# EAGLE design BitALU (EAGLE 9.2.2)
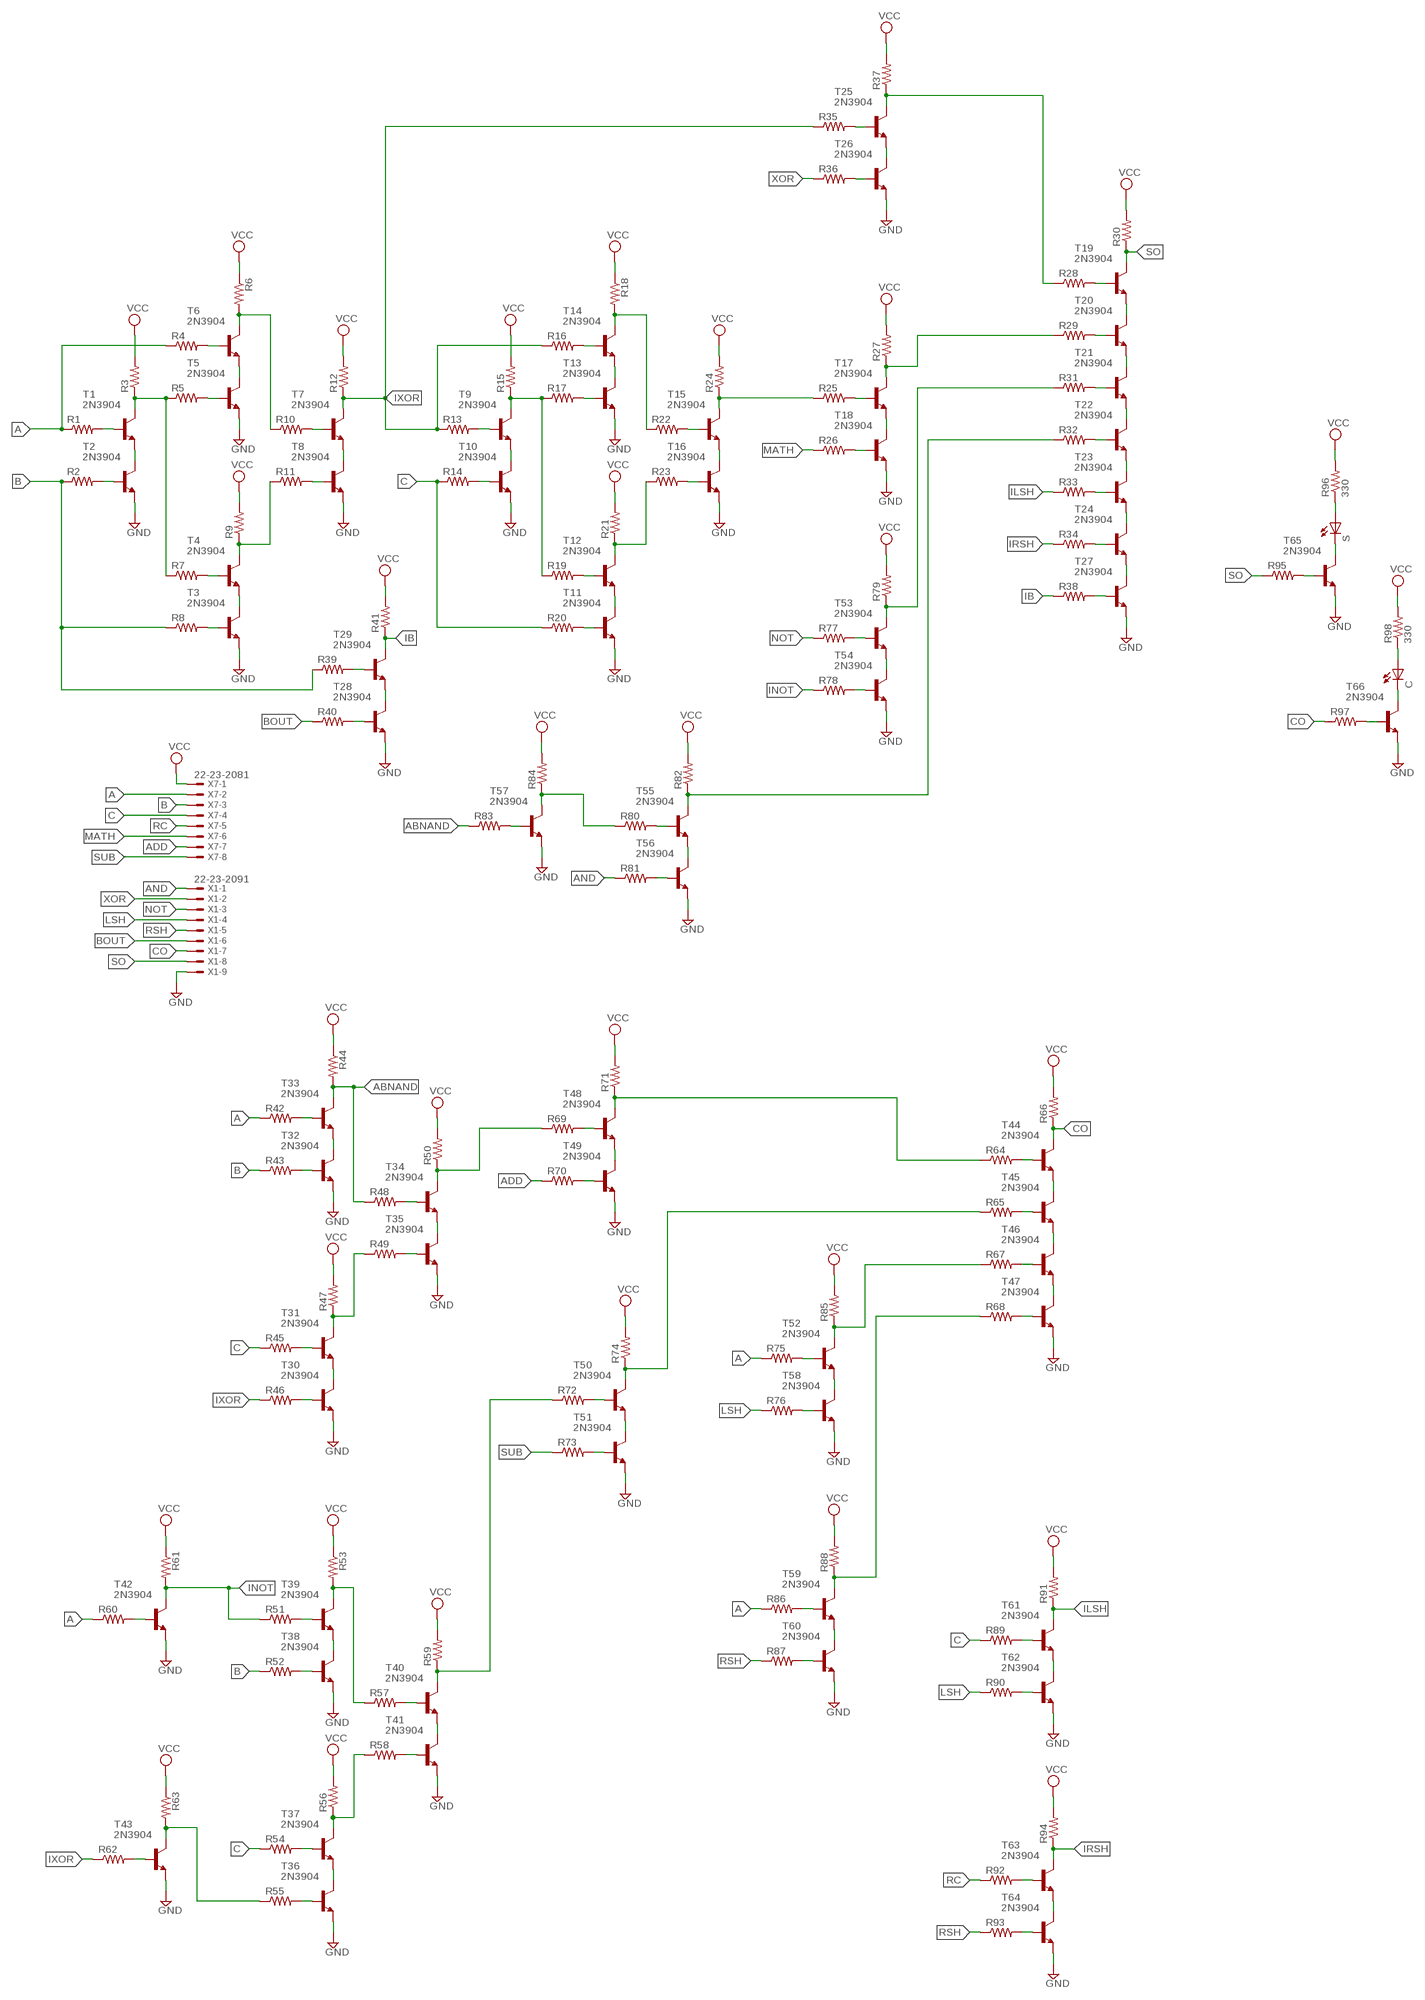
[diagram p0: schematic, sheet 1]

## Parts
C  LED5MM  [LED5MM]
R1  R-US_0309/10  [0309/10]
R2  R-US_0309/10  [0309/10]
R3  R-US_0309/10  [0309/10]
R4  R-US_0309/10  [0309/10]
R5  R-US_0309/10  [0309/10]
R6  R-US_0309/10  [0309/10]
R7  R-US_0309/10  [0309/10]
R8  R-US_0309/10  [0309/10]
R9  R-US_0309/10  [0309/10]
R10  R-US_0309/10  [0309/10]
R11  R-US_0309/10  [0309/10]
R12  R-US_0309/10  [0309/10]
R13  R-US_0309/10  [0309/10]
R14  R-US_0309/10  [0309/10]
R15  R-US_0309/10  [0309/10]
R16  R-US_0309/10  [0309/10]
R17  R-US_0309/10  [0309/10]
R18  R-US_0309/10  [0309/10]
R19  R-US_0309/10  [0309/10]
R20  R-US_0309/10  [0309/10]
R21  R-US_0309/10  [0309/10]
R22  R-US_0309/10  [0309/10]
R23  R-US_0309/10  [0309/10]
R24  R-US_0309/10  [0309/10]
R25  R-US_0309/10  [0309/10]
R26  R-US_0309/10  [0309/10]
R27  R-US_0309/10  [0309/10]
R28  R-US_0309/10  [0309/10]
R29  R-US_0309/10  [0309/10]
R30  R-US_0309/10  [0309/10]
R31  R-US_0309/10  [0309/10]
R32  R-US_0309/10  [0309/10]
R33  R-US_0309/10  [0309/10]
R34  R-US_0309/10  [0309/10]
R35  R-US_0309/10  [0309/10]
R36  R-US_0309/10  [0309/10]
R37  R-US_0309/10  [0309/10]
R38  R-US_0309/10  [0309/10]
R39  R-US_0309/10  [0309/10]
R40  R-US_0309/10  [0309/10]
R41  R-US_0309/10  [0309/10]
R42  R-US_0309/10  [0309/10]
R43  R-US_0309/10  [0309/10]
R44  R-US_0309/10  [0309/10]
R45  R-US_0309/10  [0309/10]
R46  R-US_0309/10  [0309/10]
R47  R-US_0309/10  [0309/10]
R48  R-US_0309/10  [0309/10]
R49  R-US_0309/10  [0309/10]
R50  R-US_0309/10  [0309/10]
R51  R-US_0309/10  [0309/10]
R52  R-US_0309/10  [0309/10]
R53  R-US_0309/10  [0309/10]
R54  R-US_0309/10  [0309/10]
R55  R-US_0309/10  [0309/10]
R56  R-US_0309/10  [0309/10]
R57  R-US_0309/10  [0309/10]
R58  R-US_0309/10  [0309/10]
R59  R-US_0309/10  [0309/10]
R60  R-US_0309/10  [0309/10]
R61  R-US_0309/10  [0309/10]
R62  R-US_0309/10  [0309/10]
R63  R-US_0309/10  [0309/10]
R64  R-US_0309/10  [0309/10]
R65  R-US_0309/10  [0309/10]
R66  R-US_0309/10  [0309/10]
R67  R-US_0309/10  [0309/10]
R68  R-US_0309/10  [0309/10]
R69  R-US_0309/10  [0309/10]
R70  R-US_0309/10  [0309/10]
R71  R-US_0309/10  [0309/10]
R72  R-US_0309/10  [0309/10]
R73  R-US_0309/10  [0309/10]
R74  R-US_0309/10  [0309/10]
R75  R-US_0309/10  [0309/10]
R76  R-US_0309/10  [0309/10]
R77  R-US_0309/10  [0309/10]
R78  R-US_0309/10  [0309/10]
R79  R-US_0309/10  [0309/10]
R80  R-US_0309/10  [0309/10]
R81  R-US_0309/10  [0309/10]
R82  R-US_0309/10  [0309/10]
R83  R-US_0309/10  [0309/10]
R84  R-US_0309/10  [0309/10]
R85  R-US_0309/10  [0309/10]
R86  R-US_0309/10  [0309/10]
R87  R-US_0309/10  [0309/10]
R88  R-US_0309/10  [0309/10]
R89  R-US_0309/10  [0309/10]
R90  R-US_0309/10  [0309/10]
R91  R-US_0309/10  [0309/10]
R92  R-US_0309/10  [0309/10]
R93  R-US_0309/10  [0309/10]
R94  R-US_0309/10  [0309/10]
R95  R-US_0309/10  [0309/10]
R96  330  R-US_0309/10  [0309/10]
R97  R-US_0309/10  [0309/10]
R98  330  R-US_0309/10  [0309/10]
S  LED5MM  [LED5MM]
T1  2N3904  [TO92]
T2  2N3904  [TO92]
T3  2N3904  [TO92]
T4  2N3904  [TO92]
T5  2N3904  [TO92]
T6  2N3904  [TO92]
T7  2N3904  [TO92]
T8  2N3904  [TO92]
T9  2N3904  [TO92]
T10  2N3904  [TO92]
T11  2N3904  [TO92]
T12  2N3904  [TO92]
T13  2N3904  [TO92]
T14  2N3904  [TO92]
T15  2N3904  [TO92]
T16  2N3904  [TO92]
T17  2N3904  [TO92]
T18  2N3904  [TO92]
T19  2N3904  [TO92]
T20  2N3904  [TO92]
T21  2N3904  [TO92]
T22  2N3904  [TO92]
T23  2N3904  [TO92]
T24  2N3904  [TO92]
T25  2N3904  [TO92]
T26  2N3904  [TO92]
T27  2N3904  [TO92]
T28  2N3904  [TO92]
T29  2N3904  [TO92]
T30  2N3904  [TO92]
T31  2N3904  [TO92]
T32  2N3904  [TO92]
T33  2N3904  [TO92]
T34  2N3904  [TO92]
T35  2N3904  [TO92]
T36  2N3904  [TO92]
T37  2N3904  [TO92]
T38  2N3904  [TO92]
T39  2N3904  [TO92]
T40  2N3904  [TO92]
T41  2N3904  [TO92]
T42  2N3904  [TO92]
T43  2N3904  [TO92]
T44  2N3904  [TO92]
T45  2N3904  [TO92]
T46  2N3904  [TO92]
T47  2N3904  [TO92]
T48  2N3904  [TO92]
T49  2N3904  [TO92]
T50  2N3904  [TO92]
T51  2N3904  [TO92]
T52  2N3904  [TO92]
T53  2N3904  [TO92]
T54  2N3904  [TO92]
T55  2N3904  [TO92]
T56  2N3904  [TO92]
T57  2N3904  [TO92]
T58  2N3904  [TO92]
T59  2N3904  [TO92]
T60  2N3904  [TO92]
T61  2N3904  [TO92]
T62  2N3904  [TO92]
T63  2N3904  [TO92]
T64  2N3904  [TO92]
T65  2N3904  [TO92]
T66  2N3904  [TO92]
X1  22-23-2091  [22-23-2091]
X7  22-23-2081  [22-23-2081]

## Nets
A: R1.1 R4.1 R42.1 R60.1 R75.1 R86.1 X7.2
ABNAND: R44.2 R48.1 R83.1 T33.1(C)
ADD: R70.1 X7.7
AND: R81.1 X1.1
B: R2.1 R8.1 R39.1 R43.1 R52.1 X7.3
BOUT: R40.1 X1.6
C: R14.1 R20.1 R45.1 R54.1 R89.1 X7.4
CO: R66.1 R97.1 T44.1(C) X1.7
GND: T2.3(E) T3.3(E) T5.3(E) T8.3(E) T10.3(E) T11.3(E) T13.3(E) T16.3(E) T18.3(E) T26.3(E) T27.3(E) T28.3(E) T30.3(E) T32.3(E) T35.3(E) T36.3(E) T38.3(E) T41.3(E) T42.3(E) T43.3(E) T47.3(E) T49.3(E) T51.3(E) T54.3(E) T56.3(E) T57.3(E) T58.3(E) T60.3(E) T62.3(E) T64.3(E) T65.3(E) T66.3(E) X1.9
IB: R38.1 R41.1 T29.1(C)
ILSH: R33.1 R91.1 T61.1(C)
INOT: R51.1 R61.2 R78.1 T42.1(C)
IRSH: R34.1 R94.1 T63.1(C)
IXOR: R12.1 R13.1 R16.1 R35.1 R46.1 R62.1 T7.1(C)
LSH: R76.1 R90.1 X1.4
MATH: R26.1 X7.6
N$1: R3.1 R5.1 R7.1 T1.1(C)
N$2: T1.3(E) T2.1(C)
N$3: R2.2 T2.2(B)
N$4: R1.2 T1.2(B)
N$5: R5.2 T5.2(B)
N$6: R7.2 T4.2(B)
N$7: R4.2 T6.2(B)
N$8: R6.2 R10.1 T6.1(C)
N$9: T5.1(C) T6.3(E)
N$10: R9.1 R11.1 T4.1(C)
N$11: T3.1(C) T4.3(E)
N$12: R10.2 T7.2(B)
N$13: R11.2 T8.2(B)
N$14: R28.1 R37.1 T25.1(C)
N$15: R15.1 R17.1 R19.1 T9.1(C)
N$16: R8.2 T3.2(B)
N$17: T19.3(E) T20.1(C)
N$18: T7.3(E) T8.1(C)
N$19: T9.3(E) T10.1(C)
N$20: R14.2 T10.2(B)
N$21: R13.2 T9.2(B)
N$22: R17.2 T13.2(B)
N$23: R19.2 T12.2(B)
N$24: R16.2 T14.2(B)
N$25: R18.2 R22.1 T14.1(C)
N$26: T13.1(C) T14.3(E)
N$27: R21.1 R23.1 T12.1(C)
N$28: T11.1(C) T12.3(E)
N$29: R22.2 T15.2(B)
N$30: R23.2 T16.2(B)
N$31: R24.1 R25.1 T15.1(C)
N$32: R20.2 T11.2(B)
N$33: R25.2 T17.2(B)
N$34: T15.3(E) T16.1(C)
N$35: R26.2 T18.2(B)
N$36: R27.1 R29.1 T17.1(C)
N$37: T17.3(E) T18.1(C)
N$38: T20.3(E) T21.1(C)
N$39: T21.3(E) T22.1(C)
N$40: T22.3(E) T23.1(C)
N$41: T23.3(E) T24.1(C)
N$42: R28.2 T19.2(B)
N$43: T25.3(E) T26.1(C)
N$44: R36.2 T26.2(B)
N$45: R35.2 T25.2(B)
N$46: R29.2 T20.2(B)
N$47: R31.2 T21.2(B)
N$48: R32.2 T22.2(B)
N$49: R33.2 T23.2(B)
N$50: R34.2 T24.2(B)
N$51: T24.3(E) T27.1(C)
N$52: R38.2 T27.2(B)
N$53: T32.1(C) T33.3(E)
N$54: T28.1(C) T29.3(E)
N$55: R39.2 T29.2(B)
N$56: R40.2 T28.2(B)
N$57: R43.2 T32.2(B)
N$58: R42.2 T33.2(B)
N$59: R50.1 R69.1 T34.1(C)
N$60: T34.3(E) T35.1(C)
N$61: R49.2 T35.2(B)
N$62: R48.2 T34.2(B)
N$63: R47.1 R49.1 T31.1(C)
N$64: T30.1(C) T31.3(E)
N$65: R46.2 T30.2(B)
N$66: R45.2 T31.2(B)
N$67: T44.3(E) T45.1(C)
N$68: T45.3(E) T46.1(C)
N$69: T46.3(E) T47.1(C)
N$70: R68.2 T47.2(B)
N$71: R67.2 T46.2(B)
N$72: R65.2 T45.2(B)
N$73: R64.2 T44.2(B)
N$74: R64.1 R71.1 T48.1(C)
N$75: R31.1 R79.1 T53.1(C)
N$76: T48.3(E) T49.1(C)
N$77: R70.2 T49.2(B)
N$78: R69.2 T48.2(B)
N$79: R65.1 R74.1 T50.1(C)
N$80: T50.3(E) T51.1(C)
N$81: R73.2 T51.2(B)
N$82: R72.2 T50.2(B)
N$83: R60.2 T42.2(B)
N$84: R53.2 R57.1 T39.1(C)
N$85: T38.1(C) T39.3(E)
N$86: R52.2 T38.2(B)
N$87: R51.2 T39.2(B)
N$88: R56.1 R58.1 T37.1(C)
N$89: T36.1(C) T37.3(E)
N$90: R55.2 T36.2(B)
N$91: R54.2 T37.2(B)
N$92: R59.1 R72.1 T40.1(C)
N$93: T40.3(E) T41.1(C)
N$94: R58.2 T41.2(B)
N$95: R57.2 T40.2(B)
N$96: R55.1 R63.2 T43.1(C)
N$97: R62.2 T43.2(B)
N$98: R67.1 R85.1 T52.1(C)
N$99: T52.3(E) T58.1(C)
N$100: R76.2 T58.2(B)
N$101: R75.2 T52.2(B)
N$102: R68.1 R88.1 T59.1(C)
N$103: T53.3(E) T54.1(C)
N$104: R78.2 T54.2(B)
N$105: R77.2 T53.2(B)
N$106: R83.2 T57.2(B)
N$107: R80.1 R84.1 T57.1(C)
N$108: T59.3(E) T60.1(C)
N$109: R87.2 T60.2(B)
N$110: R80.2 T55.2(B)
N$111: R32.1 R82.1 T55.1(C)
N$112: T55.3(E) T56.1(C)
N$113: R81.2 T56.2(B)
N$114: R86.2 T59.2(B)
N$115: T61.3(E) T62.1(C)
N$116: R90.2 T62.2(B)
N$117: R89.2 T61.2(B)
N$118: T63.3(E) T64.1(C)
N$119: R93.2 T64.2(B)
N$120: R92.2 T63.2(B)
N$121: R96.1 S.A
N$122: R95.2 T65.2(B)
N$123: R97.2 T66.2(B)
N$124: S.K(C) T65.1(C)
N$125: C.A R98.1
N$126: C.K(C) T66.1(C)
NOT: R77.1 X1.3
RC: R92.1 X7.5
RSH: R87.1 R93.1 X1.5
SO: R30.1 R95.1 T19.1(C) X1.8
SUB: R73.1 X7.8
VCC: R3.2 R6.1 R9.2 R12.2 R15.2 R18.1 R21.2 R24.2 R27.2 R30.2 R37.2 R41.2 R44.1 R47.2 R50.2 R53.1 R56.2 R59.2 R61.1 R63.1 R66.2 R71.2 R74.2 R79.2 R82.2 R84.2 R85.2 R88.2 R91.2 R94.2 R96.2 R98.2 X7.1
XOR: R36.1 X1.2

## Library data of the parts
C S = led:LED: LED OSRAM: - CHIPLED LG R971, LG N971, LY N971, LG Q971, LY Q971, LO R971, LY R971 LH N974, LH R974 LS Q976, LO Q976, LY Q976 LO Q996 - Hyper CHIPLED LW Q18S LB Q993, LB Q99A, LB R99A - SideLED LS A670, LO A670, LY A670, LG A670, LP A670 LB A673, LV A673, LT A673, LW A673 LH A674 LY A675 LS A676, LA A676, LO A676, LY A676, LW A676 LS A679, LY A679, LG A679 - Hyper Micro SIDELED® LS Y876, LA Y876, LO Y876, LY Y876 LT Y87S - SmartLED LW L88C, LW L88S LB L89C, LB L89S, LG L890 LS L89K, LO L89K, LY L89K LS L896, LA L896, LO L896, LY L896 - TOPLED LS T670, LO T670, LY T670, LG T670, LP T670 LSG T670, LSP T670, LSY T670, LOP T670, LYG T670 LG T671, LOG T671, LSG T671 LB T673, LV T673, LT T673, LW T673 LH T674 LS T676, LA T676, LO T676, LY T676, LB T676, LH T676, LSB T676, LW T676 LB T67C, LV T67C, LT T67C, LS T67K, LO T67K, LY T67K, LW E67C LS E67B, LA E67B, LO E67B, LY E67B, LB E67C, LV E67C, LT E67C LW T67C LS T679, LY T679, LG T679 LS T770, LO T770, LY T770, LG T770, LP T770 LB T773, LV T773, LT T773, LW T773 LH T774 LS E675, LA E675, LY E675, LS T675 LS T776, LA T776, LO T776, LY T776, LB T776 LHGB T686 LT T68C, LB T68C - Hyper Mini TOPLED® LB M676 - Mini TOPLED Santana® LG M470 LS M47K, LO M47K, LY M47K Source: http://www.osram.convergy.de LUXEON: - LUMILED® LXK2-PW12-R00, LXK2-PW12-S00, LXK2-PW14-U00, LXK2-PW14-V00 LXK2-PM12-R00, LXK2-PM12-S00, LXK2-PM14-U00 LXK2-PE12-Q00, LXK2-PE12-R00, LXK2-PE12-S00, LXK2-PE14-T00, LXK2-PE14-U00 LXK2-PB12-K00, LXK2-PB12-L00, LXK2-PB12-M00, LXK2-PB14-N00, LXK2-PB14-P00, LXK2-PB14-Q00 LXK2-PR12-L00, LXK2-PR12-M00, LXK2-PR14-Q00, LXK2-PR14-R00 LXK2-PD12-Q00, LXK2-PD12-R00, LXK2-PD12-S00 LXK2-PH12-R00, LXK2-PH12-S00 LXK2-PL12-P00, LXK2-PL12-Q00, LXK2-PL12-R00 Source: www.luxeon.com KINGBRIGHT: KA-3528ASYC Source: www.kingbright.com
R1-R98 = resistor:R-US_: RESISTOR, American symbol
T1-T66 = transistor:2N3904: NPN TRANSISTOR
X1 = con-molex:22-23-2091: .100" (2.54mm) Center Header - 9 Pin; MF: MOLEX; MPN: 22-23-2091; OC_FARNELL: 1756827; OC_NEWARK: 56H0450
X7 = con-molex:22-23-2081: .100" (2.54mm) Center Header - 8 Pin; MF: MOLEX; MPN: 22-23-2081; OC_FARNELL: 1756826; OC_NEWARK: 01C7592

## Board
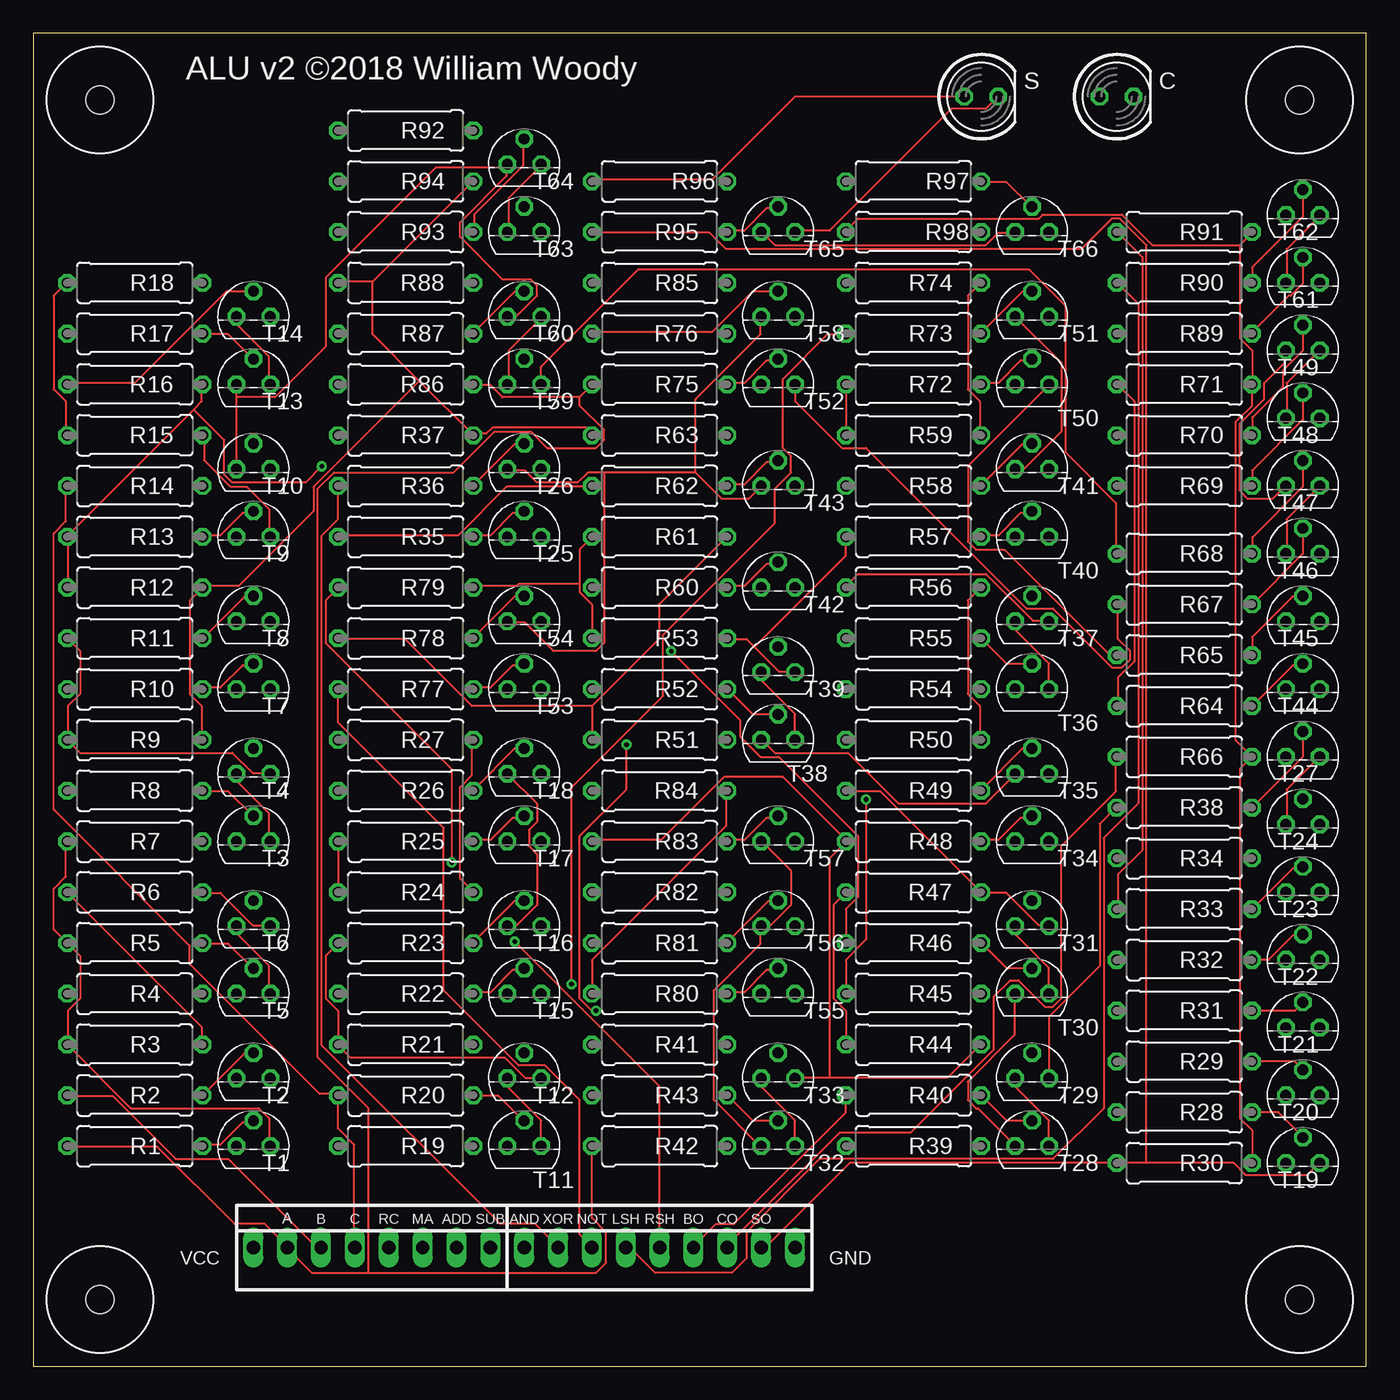
[diagram p1: board, top side]
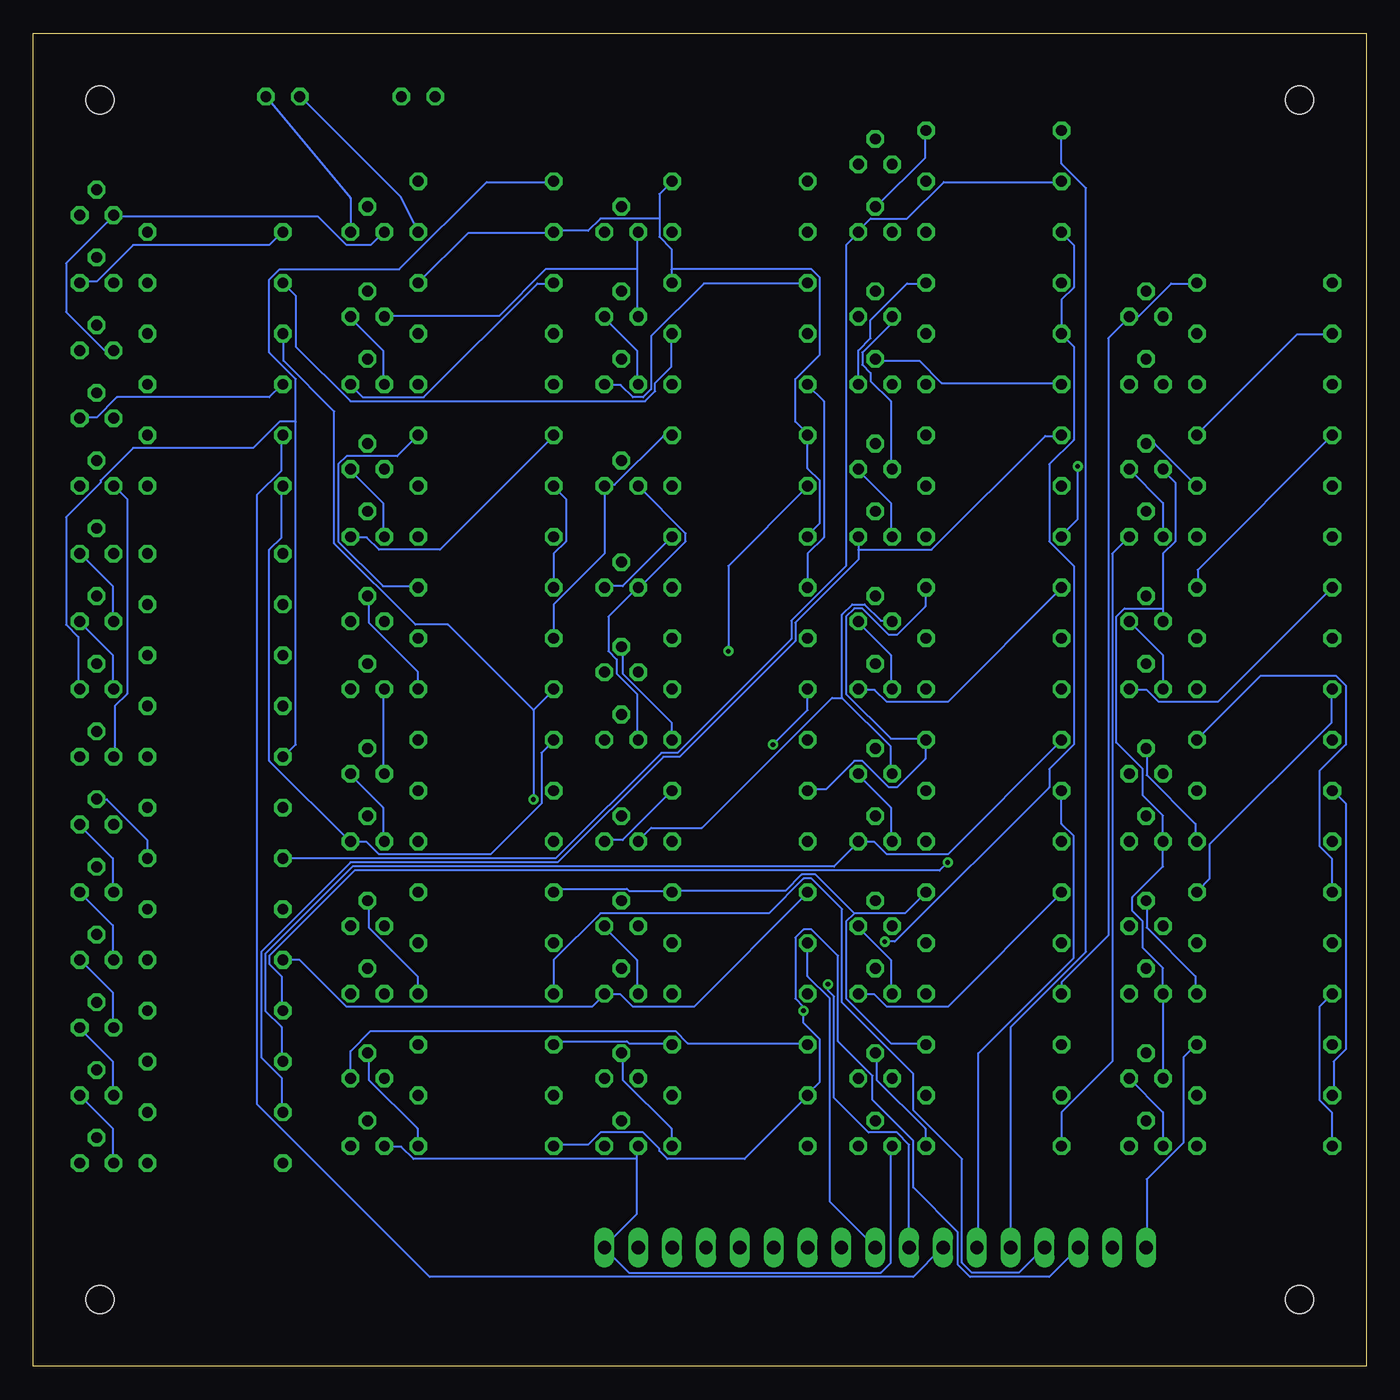
[diagram p2: board, bottom side, seen from below]

Size 100 x 100 mm. Coordinates in mm from the lower left corner, seen from the top.
Outline: 0,0 100,0 100,100 0,100 0,0
Copper layers (1*16): Top 0.035mm / dielectric 1.5mm / Bottom 0.035mm
Design rules "default": minimum track width 6mil, minimum drill 0.35mm, track to track 6mil, track to pad 6mil, pad to pad 6mil, via to via 6mil, smd to smd 6mil, copper to edge 40mil, drill to drill 6mil, minimum pad ring 10mil, minimum via ring 8mil, stop-mask expansion 4mil, vias tented up to drill 0mil, thermal gap 10mil
Holes 2.1 mm at 5,95 95,95 95,5 5,5

### Footprints (pad centres in the part's own frame; a part is rotated, then mirrored left to right if it is on the bottom)
LED5MM = drill 0.813 octagon: A -1.27,0; K 1.27,0
0309/10 = drill 0.813 octagon: 1 -5.08,0; 2 5.08,0
TO92 = drill 0.813 octagon: 1 1.27,0; 2 0,1.905; 3 -1.27,0
22-23-2091 = drill 1 long: 1 -10.16,0; 2 -7.62,0; 3 -5.08,0; 4 -2.54,0; 5 0,0; 6 2.54,0; 7 5.08,0; 8 7.62,0; 9 10.16,0
22-23-2081 = drill 1 long: 1 -8.89,0; 2 -6.35,0; 3 -3.81,0; 4 -1.27,0; 5 1.27,0; 6 3.81,0; 7 6.35,0; 8 8.89,0

### Placement (x,y rotation side)
C  81.28,95.25 0 top
R1  7.62,16.51 0 top
R2  7.62,20.32 0 top
R3  7.62,24.13 0 top
R4  7.62,27.94 0 top
R5  7.62,31.75 0 top
R6  7.62,35.56 0 top
R7  7.62,39.37 0 top
R8  7.62,43.18 0 top
R9  7.62,46.99 0 top
R10  7.62,50.8 0 top
R11  7.62,54.61 0 top
R12  7.62,58.42 0 top
R13  7.62,62.23 0 top
R14  7.62,66.04 0 top
R15  7.62,69.85 180 top
R16  7.62,73.66 180 top
R17  7.62,77.47 0 top
R18  7.62,81.28 0 top
R19  27.94,16.51 0 top
R20  27.94,20.32 0 top
R21  27.94,24.13 0 top
R22  27.94,27.94 0 top
R23  27.94,31.75 0 top
R24  27.94,35.56 0 top
R25  27.94,39.37 0 top
R26  27.94,43.18 0 top
R27  27.94,46.99 0 top
R28  86.36,19.05 0 top
R29  86.36,22.86 0 top
R30  86.36,15.24 0 top
R31  86.36,26.67 0 top
R32  86.36,30.48 0 top
R33  86.36,34.29 0 top
R34  86.36,38.1 0 top
R35  27.94,62.23 0 top
R36  27.94,66.04 0 top
R37  27.94,69.85 0 top
R38  86.36,41.91 0 top
R39  66.04,16.51 0 top
R40  66.04,20.32 0 top
R41  46.99,24.13 0 top
R42  46.99,16.51 0 top
R43  46.99,20.32 0 top
R44  66.04,24.13 0 top
R45  66.04,27.94 0 top
R46  66.04,31.75 0 top
R47  66.04,35.56 180 top
R48  66.04,39.37 0 top
R49  66.04,43.18 0 top
R50  66.04,46.99 0 top
R51  46.99,46.99 0 top
R52  46.99,50.8 0 top
R53  46.99,54.61 0 top
R54  66.04,50.8 0 top
R55  66.04,54.61 0 top
R56  66.04,58.42 0 top
R57  66.04,62.23 0 top
R58  66.04,66.04 0 top
R59  66.04,69.85 0 top
R60  46.99,58.42 0 top
R61  46.99,62.23 0 top
R62  46.99,66.04 0 top
R63  46.99,69.85 0 top
R64  86.36,49.53 0 top
R65  86.36,53.34 0 top
R66  86.36,45.72 0 top
R67  86.36,57.15 0 top
R68  86.36,60.96 0 top
R69  86.36,66.04 0 top
R70  86.36,69.85 0 top
R71  86.36,73.66 0 top
R72  66.04,73.66 0 top
R73  66.04,77.47 0 top
R74  66.04,81.28 0 top
R75  46.99,73.66 0 top
R76  46.99,77.47 180 top
R77  27.94,50.8 0 top
R78  27.94,54.61 0 top
R79  27.94,58.42 0 top
R80  46.99,27.94 0 top
R81  46.99,31.75 0 top
R82  46.99,35.56 0 top
R83  46.99,39.37 0 top
R84  46.99,43.18 180 top
R85  46.99,81.28 0 top
R86  27.94,73.66 180 top
R87  27.94,77.47 0 top
R88  27.94,81.28 180 top
R89  86.36,77.47 0 top
R90  86.36,81.28 0 top
R91  86.36,85.09 0 top
R92  27.94,92.71 0 top
R93  27.94,85.09 0 top
R94  27.94,88.9 0 top
R95  46.99,85.09 0 top
R96  46.99,88.9 0 top
R97  66.04,88.9 0 top
R98  66.04,85.09 180 top
S  71.12,95.25 0 top
T1  16.51,16.51 0 top
T2  16.51,21.59 0 top
T3  16.51,39.37 0 top
T4  16.51,44.45 0 top
T5  16.51,27.94 0 top
T6  16.51,33.02 0 top
T7  16.51,50.8 0 top
T8  16.51,55.88 0 top
T9  16.51,62.23 0 top
T10  16.51,67.31 0 top
T11  36.83,16.51 0 top
T12  36.83,21.59 0 top
T13  16.51,73.66 0 top
T14  16.51,78.74 0 top
T15  36.83,27.94 0 top
T16  36.83,33.02 0 top
T17  36.83,39.37 0 top
T18  36.83,44.45 0 top
T19  95.25,15.24 0 top
T20  95.25,20.32 0 top
T21  95.25,25.4 0 top
T22  95.25,30.48 0 top
T23  95.25,35.56 0 top
T24  95.25,40.64 0 top
T25  36.83,62.23 0 top
T26  36.83,67.31 0 top
T27  95.25,45.72 0 top
T28  74.93,16.51 0 top
T29  74.93,21.59 0 top
T30  74.93,27.94 0 top
T31  74.93,33.02 0 top
T32  55.88,16.51 0 top
T33  55.88,21.59 0 top
T34  74.93,39.37 0 top
T35  74.93,44.45 0 top
T36  74.93,50.8 0 top
T37  74.93,55.88 0 top
T38  55.88,46.99 0 top
T39  55.88,52.07 0 top
T40  74.93,62.23 0 top
T41  74.93,67.31 0 top
T42  55.88,58.42 0 top
T43  55.88,66.04 0 top
T44  95.25,50.8 0 top
T45  95.25,55.88 0 top
T46  95.25,60.96 0 top
T47  95.25,66.04 0 top
T48  95.25,71.12 0 top
T49  95.25,76.2 0 top
T50  74.93,73.66 0 top
T51  74.93,78.74 0 top
T52  55.88,73.66 0 top
T53  36.83,50.8 0 top
T54  36.83,55.88 0 top
T55  55.88,27.94 0 top
T56  55.88,33.02 0 top
T57  55.88,39.37 0 top
T58  55.88,78.74 0 top
T59  36.83,73.66 0 top
T60  36.83,78.74 0 top
T61  95.25,81.28 0 top
T62  95.25,86.36 0 top
T63  36.83,85.09 0 top
T64  36.83,90.17 0 top
T65  55.88,85.09 0 top
T66  74.93,85.09 0 top
X1  46.99,8.89 0 top
X7  25.4,8.89 0 top

### Tracks (layer width: path | path; a pad name or v marks a point on that pad's centre or on a via)
A
  Top 0.152: 41,72.69 35.2,72.69 34.29,73.61 33.07,73.61 R86.1 | 41,72.69 41.91,73.61 R75.1 | R42.1 41.91,11.12 42.98,10.06 42.98,7.77 42.22,7.01 25.15,7.01 | 25.15,7.01 20.88,7.01 19.05,8.84 X7.2 19.05,8.99 17.37,10.67 15.09,10.67 9.3,16.46 2.59,16.46 R1.1 | 41,72.69 41,72.08 42.82,70.26 42.82,69.49 42.22,68.89 38.56,68.89 37.34,70.1 34.59,70.1 31.55,67.06 22.55,67.06 21.34,65.84 21.34,23.16 25.15,19.36 25.15,7.01
  Bottom 0.152: R60.1 41.91,60.96 40.69,62.18 40.69,72.39 41.91,73.61 R75.1 | R4.1 3.5,26.98 3.5,19.96 2.59,19.05 2.59,16.61 R1.1
ABNAND
  Top 0.152: 59.74,21.64 68.58,21.64 71.02,24.08 R44.2 | 59.74,21.64 57.15,21.64 T33.1 | R83.1 41.91,39.47 47.09,39.47 51.82,44.2 56.24,44.2 60.96,39.47 R48.1 60.96,39.32 59.74,38.1 59.74,21.64
ADD
  Bottom 0.152: R70.1 81.38,69.8 81.38,67.21 83.21,65.38 83.21,19.66 70.26,6.71 33.98,6.71 31.85,8.84 X7.7
AND
  Bottom 0.152: R81.1 41.91,29.26 40.23,27.58 40.23,12.34 36.88,8.99 X1.1
B  (via drill 0.35)
  Top 0.152: v44.5,46.63 44.5,43.28 41,39.78 41,27.58 41.91,26.67 v42.22,26.67 | X7.3 21.49,8.99 21.18,8.99 14.63,15.54 10.67,15.54 5.94,20.27 2.59,20.27 R2.1
  Bottom 0.152: R39.1 60.96,16.61 58.37,16.61 57.45,17.53 54.25,17.53 53.03,16.31 53.03,16.15 52.43,15.54 46.63,15.54 41.91,20.27 R43.1 41.91,20.42 41,21.34 41,24.54 42.22,25.76 v42.22,26.67 42.22,26.98 42.82,27.58 42.82,32.16 42.22,32.77 41.6,32.77 39.62,30.79 39.62,24.38 37.03,21.79 37.03,19.96 33.98,16.92 33.98,13.41 30.63,10.06 30.63,7.62 29.72,6.71 23.77,6.71 X7.3 | R52.1 41.91,49.23 v44.5,46.63 | R2.1 2.44,20.42 2.44,22.86 1.52,23.77 1.52,42.22 2.44,43.13 R8.1
BOUT
  Top 0.152: R40.1 60.96,19.05 52.58,10.67 51.21,10.67 49.53,8.99 X1.6
C  (via drill 0.35)
  Top 0.152: R45.1 60.96,30.48 62.48,32 v62.48,42.52 | X7.4 24.08,8.99 24.08,16.61 22.86,17.83 R20.1 22.86,20.42 21.49,20.42 11.73,30.18 11.73,31.55 1.52,41.76 1.52,62.48 2.44,63.4 2.44,65.99 R14.1
  Bottom 0.152: 62.48,49.23 v62.48,42.52 | 62.48,49.23 60.96,50.75 R54.1 | 62.48,49.23 68.89,55.63 71.32,55.63 77.42,61.72 77.42,71.63 81.23,75.44 81.23,77.42 R89.1 | R45.1 60.96,30.48 57.45,33.98 44.81,33.98 42.22,36.58 41.6,36.58 39.32,34.29 39.32,27.28 33.98,21.95 33.98,19.2 30.33,15.54 30.33,7.77 29.57,7.01 26.06,7.01 24.23,8.84 X7.4
CO
  Top 0.152: R66.1 81.23,45.72 81.23,43.13 77.11,39.01 77.11,27.58 76.5,26.98 75.89,26.98 73.91,28.96 73.3,28.96 72.08,27.74 72.08,23.77 65.84,17.53 60.5,17.53 51.97,8.99 X1.7
  Bottom 0.152: 80.31,70.87 80.31,46.63 81.23,45.72 R66.1 | 80.31,70.87 80.31,74.07 82.3,76.05 82.3,81.53 81.53,82.3 72.54,82.3 65.99,88.85 60.96,88.85 R97.1 | 80.31,70.87 81.53,70.87 83.52,68.89 92.51,68.89 94.94,66.45 94.94,66.29 97.54,63.7 97.54,55.63 96.62,54.71 96.62,50.9 T44.1
GND
  Top 0.152: T18.3 37.8,42.22 37.8,40.84 37.19,40.23 37.19,39.01 37.8,38.41 37.8,34.59 36.27,33.07 35.66,33.07 T16.3 | T28.3 73.61,16.61 70.87,19.36 70.71,19.36 70.1,19.96 70.1,21.34 73.61,24.84 73.61,27.89 T30.3 | T57.3 54.71,39.32 56.84,37.19 56.84,34.59 55.32,33.07 54.71,33.07 T56.3 54.56,32.92 54.56,31.7 51.05,28.19 51.05,19.96 54.56,16.46 T32.3 | T10.3 15.24,72.69 | 15.24,72.69 T13.3 | T49.3 93.88,76.2 93.88,75.29 92.35,73.76 92.35,72.54 90.53,70.71 90.53,65.68 91.14,65.08 92.96,65.08 93.88,65.99 T47.3 | T51.3 77.11,75.29 77.11,70.1 74.37,67.36 73.76,67.36 T41.3 | T66.3 73.61,85.04 72.39,85.04 71.48,84.12 55.63,84.12 54.71,85.04 T65.3 | 35.51,89.92 35.51,89.31 32,85.8 32,84.73 35.2,81.53 37.34,81.53 37.8,81.08 37.8,80.31 36.27,78.79 35.66,78.79 T60.3 | 35.51,89.92 35.51,90.07 T64.3 35.51,89.92 | T35.3 73.61,44.35 71.48,42.22 64.92,42.22 61.11,46.02 55.63,46.02 54.71,46.94 T38.3 | 49.68,67.06 42.82,67.06 | 42.82,67.06 41.6,67.06 40.84,66.29 37.8,66.29 36.88,67.21 35.66,67.21 T26.3 | 49.68,67.06 51.66,65.08 53.65,65.08 T43.3 | 49.68,67.06 49.68,72.54 54.56,77.42 54.56,78.64 T58.3 | 15.24,72.69 18.14,72.69 21.95,76.5 21.95,81.69 30.18,89.92 35.51,89.92 | 42.82,67.06 42.82,54.25 42.22,53.65 39.01,53.65 36.88,55.78 35.66,55.78 T54.3
  Bottom 0.152: 39.32,50.14 39.32,56.39 38.56,57.15 37.64,57.15 36.42,55.93 35.66,55.93 T54.3 | 39.32,50.14 35.66,46.48 35.66,44.5 T18.3 | T11.3 35.66,16.46 35.66,7.77 36.42,7.01 55.32,7.01 57.15,8.84 X1.9 57.15,8.99 54.71,11.43 54.71,15.54 | 54.71,15.54 54.71,16.46 T32.3 | 54.71,15.54 71.48,15.54 72.39,16.46 73.61,16.46 T28.3 | 39.32,50.14 40.08,50.14 49.84,40.39 53.65,40.39 54.56,39.47 T57.3 | 15.24,56.84 15.24,60.96 14.33,61.87 14.33,66.29 15.24,67.21 T10.3 | 15.24,56.84 T8.3 | T2.3 T5.3 15.24,29.87 16.76,31.39 16.76,33.38 17.53,34.14 17.53,35.2 15.24,37.49 T3.3 15.24,41.3 16.76,42.82 16.76,44.81 18.75,46.79 18.75,56.24 18.14,56.84 15.24,56.84 | T49.3 94.64,76.2 97.54,79.1 97.54,82.75 94.03,86.26 T62.3 93.88,86.26 78.64,86.26 76.5,84.12 74.68,84.12 73.76,85.04 T66.3 | T27.3 93.88,45.72 93.88,49.53 92.96,50.44 92.96,65.08 93.88,65.99 T47.3 | 54.71,82.3 54.71,85.04 T65.3 | 54.71,82.3 54.71,78.79 T58.3 | 54.71,82.3 61.57,82.3 65.08,78.79 73.61,78.79 T51.3 | T26.3 35.66,67.36 35.66,72.39 37.19,73.91 37.19,74.52 37.8,75.13 37.8,76.05 35.66,78.18 35.66,78.64 T60.3 | T35.3 73.76,44.5 73.76,50.75 T36.3 | T38.3 54.71,47.09 54.71,50.44 56.24,51.97 56.24,53.03 56.84,53.65 56.84,56.24 54.71,58.37 T42.3 54.56,58.37 51.05,61.87 51.05,62.48 T43.3
IB
  Top 0.152: T29.1 76.2,26.21 80.01,30.02 80.01,40.69 81.23,41.91 R38.1
  Bottom 0.152: T29.1 76.2,23.62 74.68,25.15 51.82,25.15 50.9,24.23 41.91,24.23 R41.1
ILSH
  Top 0.152: R33.1 81.38,34.29 81.38,36.88 83.21,38.71 83.21,83.21 81.38,85.04 R91.1
  Bottom 0.152: T61.1 96.47,81.38 95.25,81.38 92.51,84.12 82.3,84.12 81.38,85.04 R91.1
INOT
  Top 0.152: 41.91,49.53 R51.1 | 41.91,49.53 46.94,54.56 46.94,57.15 51.97,62.18 R61.2 | 41.91,49.53 32.92,49.53 27.89,54.56 22.86,54.56 R78.1
  Bottom 0.152: R61.2 55.78,58.52 57.15,58.52 T42.1
IRSH
  Bottom 0.152: R34.1 60.81,38.1 52.88,46.02 51.66,46.02 43.13,54.56 43.13,55.93 39.01,60.05 39.01,84.12 38.1,85.04 T63.1 38.1,85.19 37.19,86.11 34.44,86.11 31.7,88.85 22.86,88.85 R94.1
IXOR  (via drill 0.35)
  Top 0.152: R12.1 2.59,58.52 2.59,62.18 R13.1 2.59,62.33 12.04,71.78 | 12.04,71.78 12.65,72.39 12.65,73.61 R16.1 | R46.1 60.96,34.29 61.87,35.2 61.87,39.78 55.93,45.72 54.56,45.72 53.03,47.24 53.03,48.46 v47.85,53.65 | R35.1 22.86,62.33 31.85,62.33 35.51,65.99 41.91,65.99 R62.1 | 12.04,71.78 14.33,69.49 14.33,66.9 14.94,66.29 20.42,66.29 v21.64,67.51
  Bottom 0.152: R12.1 11.12,49.84 15.54,49.84 16.46,50.75 17.68,50.75 T7.1 | v47.85,53.65 47.85,60.05 41.91,65.99 R62.1 | v21.64,67.51 21.64,63.55 22.86,62.33 R35.1
LSH
  Top 0.152: X1.4 44.5,8.84 44.81,8.84 46.63,7.01 52.43,7.01 53.49,8.08 53.49,10.06 58.98,15.54 76.5,15.54 80.31,19.36 80.31,39.62 82.91,42.22 82.91,79.7 81.38,81.23 R90.1
  Bottom 0.152: R90.1 80.31,80.31 80.31,76.5 76.2,72.39 54.1,72.39 53.34,73.15 53.34,73.76 52.12,74.98 52.12,77.42 R76.1
MATH
  Bottom 0.152: R26.1 22.86,40.69 21.95,39.78 21.95,30.63 29.11,23.47 29.11,8.99 X7.6
N$1
  Top 0.152: T1.1 17.68,16.61 17.68,18.59 16.92,19.36 7.32,19.36 R3.1 2.59,24.23 2.59,26.67 3.5,27.58 3.5,30.79 R5.1 1.52,32.77 1.52,35.81 2.44,36.73 2.44,39.32 R7.1
N$2
  Bottom 0.152: T1.3 15.24,19.05 T2.1
N$3
  Top 0.152: R2.2 15.85,23.47 16.46,23.47 T2.2
N$4
  Top 0.152: R1.2 12.8,16.61 14.02,16.61 15.7,18.29 16.46,18.29 T1.2
N$5
  Top 0.152: R5.2 12.8,31.7 14.63,31.7 16.46,29.87 T5.2
N$6
  Bottom 0.152: R7.2 12.8,39.47 12.8,40.69 16.46,44.35 16.46,46.33 T4.2
N$7
  Bottom 0.152: R4.2 12.8,28.04 12.8,29.26 16.46,32.92 16.46,34.9 T6.2
N$8
  Top 0.152: T6.1 17.68,33.07 16.46,33.07 14.02,35.51 12.8,35.51 R6.2
  Bottom 0.152: R10.1 2.59,50.75 2.59,48.31 11.73,39.17 11.73,36.58 12.65,35.66 R6.2
N$9
  Top 0.152: T6.3 15.24,32.46 17.68,30.02 17.68,28.04 T5.1
N$10
  Top 0.152: R11.1 3.5,53.65 3.5,50.44 2.59,49.53 2.59,47.09 R9.1 3.5,46.02 14.94,46.02 16.46,44.5 17.68,44.5 T4.1
N$11
  Top 0.152: T4.3 15.24,43.89 17.68,41.45 17.68,39.47 T3.1
N$12
  Top 0.152: R10.2 12.8,50.9 14.02,50.9 15.7,52.58 16.46,52.58 T7.2
N$13
  Top 0.152: R11.2 15.85,57.76 16.46,57.76 T8.2
N$14
  Bottom 0.152: T25.1 38.1,61.27 | 38.1,61.27 38.1,60.5 42.82,55.78 42.82,54.41 51.51,45.72 52.73,45.72 60.66,37.8 76.2,37.8 82.91,31.09 82.91,23.16 81.38,21.64 81.38,19.05 R28.1 | 38.1,61.27 32.61,61.27 24.08,69.8 22.86,69.8 R37.1
N$15
  Top 0.152: T9.1 17.68,62.33 17.68,64.31 16,65.99 14.78,65.99 12.8,67.97 12.8,69.8 R15.1
  Bottom 0.152: R17.1 2.59,77.42 5.18,77.42 12.65,69.95 R15.1 | R19.1 22.86,19.05 19.05,22.86 19.05,60.96 T9.1
N$16
  Top 0.152: R8.2 12.8,43.13 14.63,43.13 16.46,41.3 T3.2
N$17
  Bottom 0.152: T20.1 94.03,17.83 94.03,15.24 T19.3
N$18
  Bottom 0.152: T7.3 15.24,53.34 T8.1
N$19
  Bottom 0.152: T9.3 15.24,64.77 T10.1
N$20
  Bottom 0.152: R14.2 15.85,69.19 16.46,69.19 T10.2
N$21
  Top 0.152: R13.2 12.8,62.33 14.02,62.33 15.7,64.01 16.46,64.01 T9.2
N$22
  Top 0.152: R17.2 12.8,77.42 14.63,77.42 16.46,75.59 T13.2
N$23
  Bottom 0.152: R19.2 33.07,16.61 33.07,17.83 36.73,21.49 36.73,23.47 T12.2
N$24
  Top 0.152: R16.2 2.59,73.76 7.62,73.76 14.48,80.62 16.46,80.62 T14.2
N$25
  Bottom 0.152: R18.2 12.8,81.23 14.63,81.23 17.07,78.79 17.68,78.79 T14.1 17.83,78.64 19.36,77.11 19.36,32.31 22.86,28.8 R22.1
N$26
  Top 0.152: T14.3 15.24,78.18 17.68,75.74 17.68,73.76 T13.1
N$27
  Top 0.152: R23.1 22.86,31.7 21.95,30.79 21.95,27.58 22.86,26.67 R21.1 22.86,24.08 23.77,23.16 35.36,23.16 36.88,21.64 38.1,21.64 T12.1
N$28
  Top 0.152: T11.1 38.1,18.44 35.66,20.88 35.66,21.49 T12.3
N$29
  Top 0.152: R22.2 33.07,28.04 34.29,28.04 35.97,29.72 36.73,29.72 T15.2
N$30
  Top 0.152: R23.2 33.07,31.85 36.12,34.9 36.73,34.9 T16.2
N$31
  Top 0.152: R25.1 R24.1
  Bottom 0.152: T15.1 38.1,27.89 36.88,27.89 35.97,26.98 31.39,26.98 22.86,35.51 R24.1
N$32
  Top 0.152: R20.2 33.07,20.27 34.9,20.27 36.73,18.44 T11.2
N$33
  Top 0.152: R25.2 33.07,39.47 34.29,39.47 35.97,41.15 36.73,41.15 T17.2
N$34
  Bottom 0.152: T15.3 35.66,28.04 35.66,30.48 38.1,32.92 T16.1
N$35
  Top 0.152: R26.2 33.07,43.28 36.12,46.33 36.73,46.33 T18.2
N$36
  Bottom 0.152: 38.1,39.32 36.88,39.32 35.97,38.41 31.39,38.41 22.86,46.94 R27.1 | 38.1,39.32 39.93,37.49 76.05,37.49 82.6,30.94 82.6,26.67 81.38,25.45 81.38,22.86 R29.1 | 38.1,39.32 T17.1
N$37
  Bottom 0.152: T17.3 35.66,39.47 35.66,41.91 38.1,44.35 T18.1
N$38
  Bottom 0.152: T20.3 94.03,20.42 94.03,22.86 96.47,25.3 T21.1
N$39
  Bottom 0.152: T21.3 94.03,25.45 94.03,28.04 96.47,30.48 T22.1
N$40
  Bottom 0.152: T23.1 94.03,33.07 94.03,30.48 T22.3
N$41
  Bottom 0.152: T23.3 94.03,35.66 94.03,38.1 96.47,40.54 T24.1
N$42
  Top 0.152: R28.2 93.42,19.05 95.25,17.22 T19.2
N$43
  Bottom 0.152: T25.3 35.66,62.33 35.66,64.77 38.1,67.21 T26.1
N$44
  Top 0.152: R36.2 33.07,66.14 36.12,69.19 36.73,69.19 T26.2
N$45
  Top 0.152: R35.2 33.07,62.33 34.29,62.33 35.97,64.01 36.73,64.01 T25.2
N$46
  Top 0.152: R29.2 94.64,22.86 95.25,22.25 T20.2
N$47
  Top 0.152: R31.2 94.64,26.67 95.25,27.28 T21.2
N$48
  Top 0.152: R32.2 92.66,30.48 94.49,32.31 95.25,32.31 T22.2
N$49
  Top 0.152: R33.2 94.49,37.34 95.25,37.34 T23.2
N$50
  Bottom 0.152: R34.2 91.44,39.47 94.49,42.52 95.25,42.52 T24.2
N$51
  Top 0.152: T24.3 94.03,40.69 94.03,43.28 96.47,45.72 T27.1
N$52
  Top 0.152: R38.2 95.25,45.72 T27.2
N$53
  Top 0.152: T32.1 57.15,18.44 54.71,20.88 54.71,21.49 T33.3
N$54
  Top 0.152: T28.1 76.2,18.44 73.76,20.88 73.76,21.49 T29.3
N$55
  Bottom 0.152: R39.2 71.17,16.61 71.17,17.83 74.83,21.49 74.83,23.47 T29.2
N$56
  Top 0.152: R40.2 73,18.44 74.83,18.44 T28.2
N$57
  Top 0.152: R43.2 53.95,18.44 55.78,18.44 T32.2
N$58
  Bottom 0.152: R42.2 52.12,16.61 52.12,17.83 55.78,21.49 55.78,23.47 T33.2
N$59
  Bottom 0.152: 76.2,39.32 74.98,39.32 74.07,38.41 65.68,38.41 61.87,42.22 61.87,46.02 60.96,46.94 R50.1 | 76.2,39.32 82.3,45.41 82.3,61.27 81.38,62.18 81.38,65.99 R69.1 | 76.2,39.32 T34.1
N$60
  Bottom 0.152: T34.3 73.76,39.47 73.76,41.91 76.2,44.35 T35.1
N$61
  Top 0.152: R49.2 71.17,43.28 74.22,46.33 74.83,46.33 T35.2
N$62
  Top 0.152: R48.2 71.17,39.47 72.39,39.47 74.07,41.15 74.83,41.15 T34.2
N$63
  Top 0.152: T31.1 76.2,33.07 75.44,33.07 73,35.51 71.17,35.51 R47.1 63.55,43.13 60.96,43.13 R49.1
N$64
  Top 0.152: T30.1 76.2,29.87 73.76,32.31 73.76,32.92 T31.3
N$65
  Top 0.152: R46.2 73,29.87 74.83,29.87 T30.2
N$66
  Bottom 0.152: R45.2 71.17,28.04 71.17,29.26 74.83,32.92 74.83,34.9 T31.2
N$67
  Bottom 0.152: T44.3 94.03,50.9 94.03,53.34 96.47,55.78 T45.1
N$68
  Bottom 0.152: T45.3 94.03,55.93 94.03,58.52 96.47,60.96 T46.1
N$69
  Top 0.152: T47.1 94.03,63.55 94.03,60.96 T46.3
N$70
  Top 0.152: R68.2 91.44,62.18 95.25,65.99 T47.2
N$71
  Top 0.152: R67.2 95.25,60.96 T46.2
N$72
  Top 0.152: R65.2 91.44,54.71 94.49,57.76 95.25,57.76 T45.2
N$73
  Top 0.152: R64.2 94.49,52.58 95.25,52.58 T44.2
N$74
  Top 0.152: R64.1 81.38,49.53 81.38,51.66 82.6,52.88 82.6,72.39 81.38,73.61 R71.1
  Bottom 0.152: T48.1 96.47,71.17 95.25,71.17 93.73,72.69 82.3,72.69 81.38,73.61 R71.1
N$75  (via drill 0.35)
  Top 0.152: v31.39,37.8 31.39,44.81 21.95,54.25 21.95,57.45 22.86,58.37 R79.1
  Bottom 0.152: T53.1 38.1,50.75 36.88,50.75 35.97,49.84 31.39,49.84 22.86,58.37 R79.1 | v31.39,37.8 32,37.19 75.89,37.19 82.3,30.79 82.3,30.18 81.38,29.26 81.38,26.67 R31.1
N$76
  Top 0.152: T48.3 94.03,71.17 94.03,73.76 96.47,76.2 T49.1
N$77
  Top 0.152: R70.2 91.44,71.17 93.73,73.46 93.73,74.68 95.25,76.2 T49.2
N$78
  Top 0.152: R69.2 91.44,67.21 95.25,71.02 T48.2
N$79
  Top 0.152: R65.1 80.77,53.34 72.85,61.27 70.71,61.27 70.1,61.87 70.1,67.51 76.2,73.61 T50.1
  Bottom 0.152: R74.1 60.96,81.23 62.18,81.23 70.71,72.69 75.29,72.69 76.2,73.61 T50.1
N$80
  Bottom 0.152: T50.3 73.76,73.76 73.76,76.2 76.2,78.64 T51.1
N$81
  Top 0.152: R73.2 71.17,77.57 74.22,80.62 74.83,80.62 T51.2
N$82
  Top 0.152: R72.2 71.17,73.76 72.39,73.76 74.07,75.44 74.83,75.44 T50.2
N$83
  Top 0.152: R60.2 52.12,58.52 53.34,58.52 55.02,60.2 55.78,60.2 T42.2
N$84
  Top 0.152: 54.1,53.95 53.49,54.56 52.12,54.56 R53.2 | 54.1,53.95 55.93,52.12 57.15,52.12 T39.1 | R57.1 60.96,60.81 54.1,53.95
N$85
  Top 0.152: T38.1 57.15,48.92 54.71,51.36 54.71,51.97 T39.3
N$86
  Top 0.152: R52.2 53.95,48.92 55.78,48.92 T38.2
N$87
  Bottom 0.152: R51.2 52.12,47.09 52.12,48.31 55.78,51.97 55.78,53.95 T39.2
N$88
  Top 0.152: T37.1 76.2,55.93 74.98,55.93 71.48,59.44 61.87,59.44 60.96,58.52 R56.1
  Bottom 0.152: R56.1 60.96,60.96 60.05,61.87 60.05,65.08 60.96,65.99 R58.1
N$89
  Top 0.152: T36.1 76.2,52.73 73.76,55.17 73.76,55.78 T37.3
N$90
  Top 0.152: R55.2 73,52.73 74.83,52.73 T36.2
N$91
  Bottom 0.152: R54.2 71.17,50.9 71.17,52.12 74.83,55.78 74.83,57.76 T37.2
N$92
  Top 0.152: R72.1 R59.1
  Bottom 0.152: T40.1 76.2,62.18 74.98,62.18 74.07,61.27 69.49,61.27 60.96,69.8 R59.1
N$93
  Bottom 0.152: T40.3 73.76,62.33 73.76,64.77 76.2,67.21 T41.1
N$94
  Top 0.152: R58.2 71.17,66.14 74.22,69.19 74.83,69.19 T41.2
N$95
  Top 0.152: R57.2 71.17,62.33 72.39,62.33 74.07,64.01 74.83,64.01 T40.2
N$96
  Bottom 0.152: R63.2 52.12,69.8 52.73,69.8 56.39,66.14 57.15,66.14 T43.1 57.15,60.96 60.96,57.15 R55.1
N$97
  Top 0.152: R62.2 52.12,66.14 53.34,66.14 55.02,67.82 55.78,67.82 T43.2
N$98
  Top 0.152: T52.1 57.15,72.39 60.66,68.89 62.48,68.89 74.52,56.84 76.5,56.84 80.92,52.43 81.69,52.43 82.3,53.03 82.3,53.65 81.38,54.56 81.38,57.15 R67.1
  Bottom 0.152: T52.1 57.15,73.61 55.93,73.61 55.02,72.69 54.25,72.69 53.65,73.3 53.65,77.27 49.68,81.23 41.91,81.23 R85.1
N$99
  Bottom 0.152: T52.3 54.71,73.76 54.71,76.2 57.15,78.64 T58.1
N$100
  Top 0.152: R76.2 41.91,77.57 50.9,77.57 53.95,80.62 55.78,80.62 T58.2
N$101
  Top 0.152: R75.2 52.12,73.76 53.34,73.76 55.02,75.44 55.78,75.44 T52.2
N$102
  Top 0.152: T59.1 38.1,74.98 45.41,82.3 74.68,82.3 77.42,79.55 77.42,68.58 81.23,64.77 81.23,60.96 R68.1
  Bottom 0.152: T59.1 38.1,76.2 37.19,77.11 37.19,78.49 34.44,81.23 33.07,81.23 R88.1
N$103
  Bottom 0.152: T53.3 35.66,50.9 35.66,53.34 38.1,55.78 T54.1
N$104
  Top 0.152: R78.2 33.07,54.71 36.12,57.76 36.73,57.76 T54.2
N$105
  Top 0.152: R77.2 33.07,50.9 34.29,50.9 35.97,52.58 36.73,52.58 T53.2
N$106
  Top 0.152: R83.2 52.12,39.47 53.34,39.47 55.02,41.15 55.78,41.15 T57.2
N$107
  Top 0.152: R80.1 41.91,30.48 51.97,40.54 51.97,43.13 R84.1
  Bottom 0.152: R84.1 55.78,39.47 57.15,39.47 T57.1
N$108
  Top 0.152: T59.3 35.66,73.76 35.66,76.2 38.1,78.64 T60.1
N$109
  Top 0.152: R87.2 33.07,77.57 36.12,80.62 36.73,80.62 T60.2
N$110
  Top 0.152: R80.2 52.12,28.04 53.34,28.04 55.02,29.72 55.78,29.72 T55.2
N$111
  Bottom 0.152: 57.15,27.89 55.93,27.89 55.02,26.98 50.44,26.98 41.91,35.51 R82.1 | R32.1 80.01,30.48 76.5,26.98 58.06,26.98 57.15,27.89 | 57.15,27.89 T55.1
N$112
  Bottom 0.152: T55.3 54.71,28.04 54.71,30.48 57.15,32.92 T56.1
N$113
  Top 0.152: R81.2 52.12,31.85 55.17,34.9 55.78,34.9 T56.2
N$114
  Bottom 0.152: R86.2 22.86,73.76 31.85,73.76 33.53,75.44 36.73,75.44 T59.2
N$115
  Top 0.152: T61.3 94.03,81.38 94.03,83.82 96.47,86.26 T62.1
N$116
  Top 0.152: R90.2 91.44,82.45 95.25,86.26 T62.2
N$117
  Top 0.152: T61.2 95.25,81.23 94.34,80.31 94.18,80.31 91.44,77.57 R89.2
N$118
  Top 0.152: T63.3 35.66,85.19 35.66,87.63 38.1,90.07 T64.1
N$119
  Top 0.152: R93.2 33.07,85.19 33.07,86.41 36.73,90.07 36.73,92.05 T64.2
N$120
  Bottom 0.152: R92.2 33.07,92.66 33.07,90.68 36.73,87.02 T63.2
N$121
  Top 0.152: S.A 57.15,95.25 50.9,89 41.91,89 R96.1
N$122
  Top 0.152: R95.2 52.12,85.19 53.34,85.19 55.02,86.87 55.78,86.87 T65.2
N$123
  Top 0.152: R97.2 71.17,88.85 73,88.85 74.83,87.02 T66.2
N$124
  Top 0.152: S.K 71.48,94.34 68.89,94.34 59.74,85.19 57.15,85.19 T65.1
N$125
  Bottom 0.152: C.A 79.96,95.25 72.44,87.73 R98.1
N$126
  Bottom 0.152: T66.1 76.2,87.63 C.K
NOT
  Top 0.152: R77.1 22.86,48.31 30.79,40.39 30.79,28.19 36.42,22.55 38.41,22.55 41,19.96 41,9.91 41.91,8.99 X1.3
RC
  Bottom 0.152: R92.1 22.86,90.22 21.03,88.39 21.03,31.09 26.67,25.45 X7.5
RSH  (via drill 0.35)
  Top 0.152: v36.12,31.85 46.94,21.03 46.94,8.99 X1.5
  Bottom 0.152: R93.1 22.86,85.04 21.95,84.12 21.95,80.92 22.86,80.01 R87.1 22.86,77.42 21.95,76.5 21.95,69.49 23.77,67.67 23.77,61.87 21.95,60.05 21.95,46.63 23.77,44.81 23.77,43.43 35.36,31.85 v36.12,31.85
SO
  Top 0.152: 83.52,15.24 90.07,15.24 90.98,14.33 95.56,14.33 96.47,15.24 T19.1 | 83.52,15.24 R30.1 61.27,15.24 55.02,8.99 54.71,8.99 X1.8 | 83.52,15.24 83.52,84.12 81.53,86.11 80.92,86.11 78.64,83.82 51.97,83.82 50.75,85.04 41.91,85.04 R95.1
SUB  (via drill 0.35)
  Top 0.152: v40.39,28.65 40.39,43.43 47.24,50.29 47.24,54.86 55.63,63.25 55.63,65.84 56.84,67.06 56.84,68.28 56.24,68.89 56.24,74.07 59.59,77.42 60.96,77.42 R73.1
  Bottom 0.152: v40.39,28.65 40.39,28.19 39.93,27.74 39.93,20.12 37.34,17.53 35.2,17.53 34.29,16.61 X7.8
VCC
  Top 0.152: R6.1 12.65,25.45 12.65,24.23 R3.2 | R9.2 12.65,47.09 12.65,49.53 11.73,50.44 11.73,57.45 R12.2 12.8,58.52 15.39,58.52 21.03,64.16 21.03,65.99 28.96,73.91 | R15.2 2.44,69.95 2.44,72.39 1.52,73.3 1.52,80.31 2.44,81.23 R18.1 | 90.53,84.12 90.53,77.11 91.44,76.2 R71.2 91.44,72.08 90.22,70.87 90.22,46.94 R66.2 90.53,44.81 90.53,18.59 91.44,17.68 R30.2 | 90.53,84.12 91.44,85.04 R91.2 | R50.2 71.02,47.09 71.02,49.53 70.1,50.44 70.1,57.45 71.02,58.37 R56.2 | R59.2 71.02,69.95 71.02,72.39 70.1,73.3 70.1,80.31 71.02,81.23 R74.2 | R44.1 60.96,26.67 60.05,27.58 60.05,34.59 60.96,35.51 R47.2 | R24.2 32,36.58 32,43.43 32.92,44.35 32.92,46.94 R27.2 | 25.45,81.38 22.86,81.38 R88.2 | 25.45,81.38 32.92,88.85 R94.2 | R63.1 41.91,69.95 41.45,70.41 34.44,70.41 33.98,69.95 33.07,69.95 R37.2 28.96,73.91 | R53.1 41.91,57.15 41,58.06 41,58.67 | 41,58.67 41,61.27 41.91,62.18 R61.1 | 41,58.67 36.42,58.67 36.27,58.52 33.07,58.52 R79.2 | 25.45,81.38 25.45,77.42 28.96,73.91 | 90.53,84.12 83.97,84.12 81.69,86.41 75.74,86.41 75.44,86.11 61.87,86.11 60.96,85.19 R98.2
  Bottom 0.152: X7.1 16.46,8.99 16.46,14.02 13.72,16.76 13.72,23.16 12.8,24.08 R3.2 | R15.2 12.65,59.74 12.65,58.52 R12.2 | R6.1 2.59,35.66 2.59,38.1 3.5,39.01 3.5,44.65 1.52,46.63 1.52,51.05 2.29,51.82 7.92,51.82 12.65,47.09 R9.2 | 52.12,82.3 52.12,83.82 53.03,84.73 53.03,86.11 | 52.12,82.3 52.12,81.38 R85.2 | 53.03,86.11 53.03,87.94 R96.2 | 53.03,86.11 57.45,86.11 58.37,85.19 60.96,85.19 R98.2 60.96,85.04 67.36,85.04 R74.2 | R59.2 72.69,68.28 76.5,68.28 77.11,67.67 77.11,61.87 73.76,58.52 71.17,58.52 R56.2 | R41.2 52.12,24.23 55.32,24.23 55.47,24.38 60.81,24.38 60.96,24.23 R44.1 | R47.2 60.96,35.66 60.81,35.81 55.47,35.81 55.32,35.66 52.12,35.66 R82.2 51.97,35.66 43.59,35.66 42.37,36.88 41.3,36.88 38.41,33.98 | 38.41,33.98 39.01,33.38 39.01,27.58 35.66,24.23 33.07,24.23 R21.2 | 38.41,33.98 34.59,33.98 R24.2 | R84.2 41.91,43.28 40.54,43.28 38.41,45.41 37.8,45.41 35.81,43.43 35.2,43.43 33.07,45.57 33.07,46.94 R27.2 33.07,47.09 35.66,47.09 39.01,50.44 39.01,56.24 38.41,56.84 37.8,56.84 35.81,54.86 35.2,54.86 33.07,57 33.07,58.37 R79.2 | R61.1 41.91,62.33 41,63.25 41,66.45 41.91,67.36 R63.1 41.91,69.95 42.82,70.87 42.82,74.07 41,75.89 41,81.69 41.6,82.3 52.12,82.3
XOR
  Top 0.152: R36.1 22.86,63.55 21.64,62.33 21.64,24.08 35.05,10.67 37.64,10.67 39.32,8.99 X1.2

### Text on the board
tPlace: ALU v2 ©2018 William Woody | A | B | C | RC | MA | ADD | SUB | AND | XOR | NOT | LSH | RSH | BO | CO | SO | VCC | GND